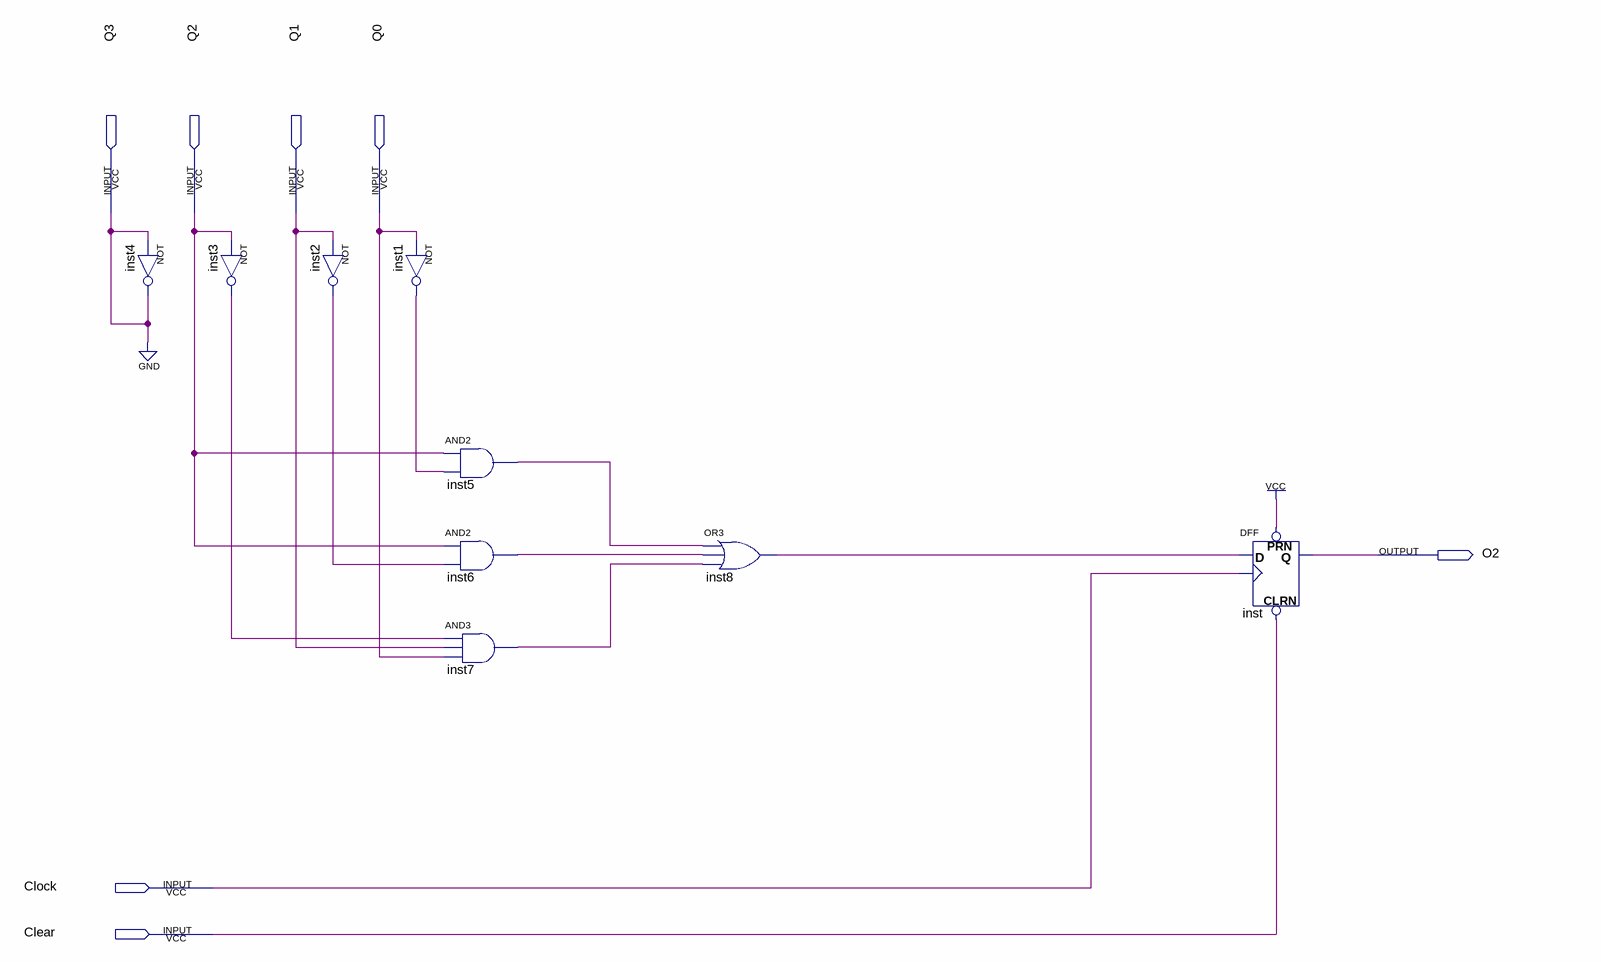
[diagram p0: schematic sheet]
// Quartus schematic D2.bdf as structural Verilog: 9 symbols, 7 pins
module D2 (
  input  Q3,
  input  Q2,
  input  Q1,
  input  Q0,
  input  Clock,
  input  Clear,
  output O2
);

  wire inst1_out, inst2_out, inst3_out, inst5_out, inst6_out, inst7_out, inst8_out;

  not inst4 (Q3, Q3);
  not inst3 (inst3_out, Q2);
  not inst2 (inst2_out, Q1);
  not inst1 (inst1_out, Q0);
  and inst5 (inst5_out, Q2, inst1_out);
  and inst6 (inst6_out, Q2, inst2_out);
  and inst7 (inst7_out, inst3_out, Q1, Q0);
  or inst8 (inst8_out, inst5_out, inst6_out, inst7_out);
  DFF inst (.CLRN(Clear), .CLK(Clock), .D(inst8_out), .PRN(1'b1), .Q(O2));
  // also tied to GND on the sheet: Q3
endmodule
